# EAGLE design sensorTensao rev5.1 (EAGLE 8.5.1)
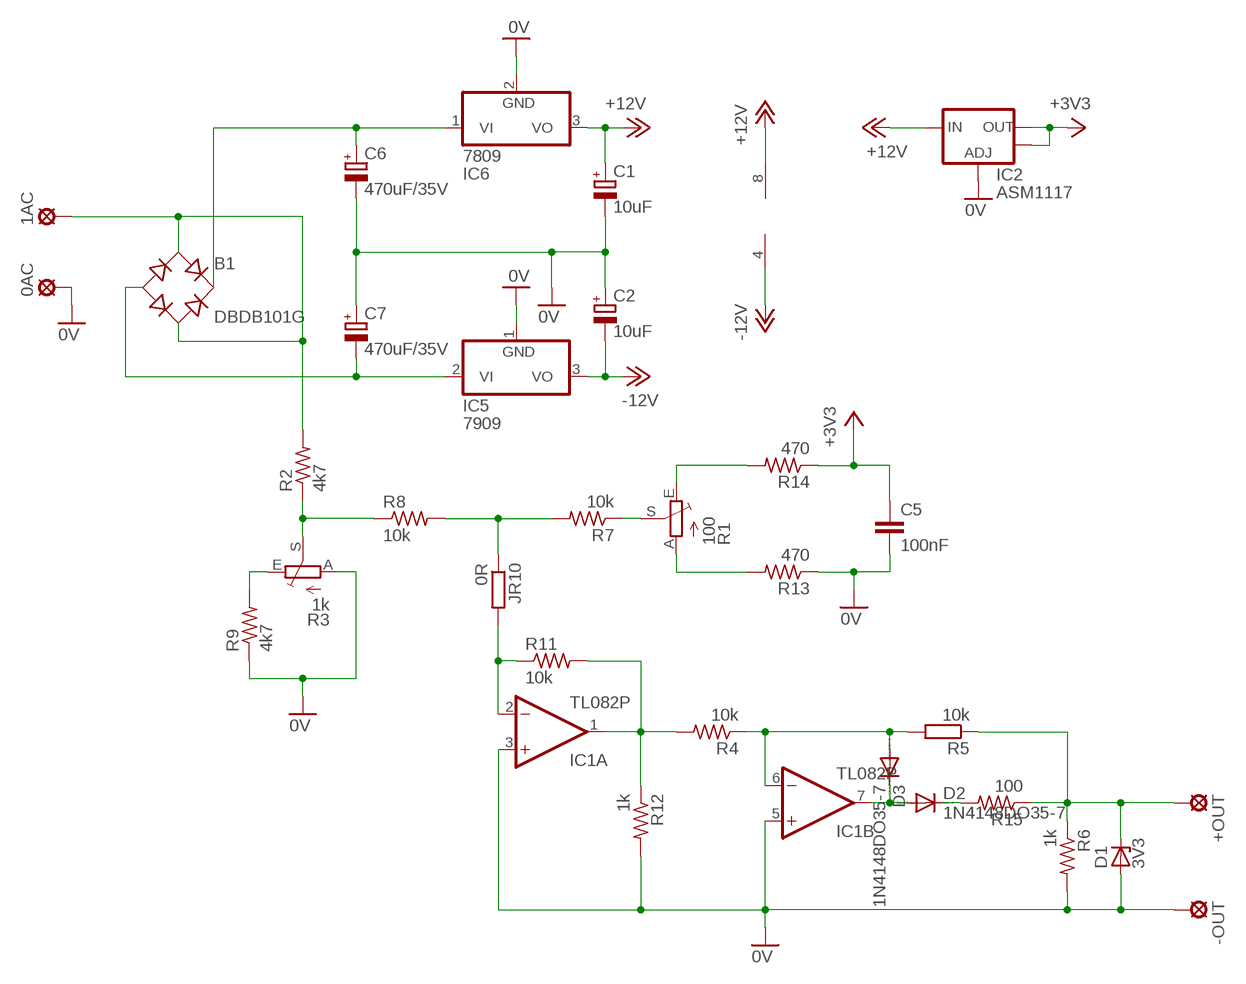
[diagram p0: schematic, sheet 1]

## Parts
0AC  0V  LSP10  [LSP10]
1AC  AC  LSP10  [LSP10]
+OUT  +D  LSP10  [LSP10]
-OUT  0V  LSP10  [LSP10]
B1  DBDB101G  [DB]
C1  10uF  CPOL-EUE2.5-7  [E2,5-7]
C2  10uF  CPOL-EUE2.5-7  [E2,5-7]
C5  100nF  C-EU050-024X044  [C050-024X044]
C6  470uF/35V  CPOL-EUE3.5-10  [E3,5-10]
C7  470uF/35V  CPOL-EUE3.5-10  [E3,5-10]
D1  3V3  ZENER-DIODEDO35-7Z  [DO35-7Z]
D2  1N4148DO35-7  [DO35-7]
D3  1N4148DO35-7  [DO35-7]
IC1  TL082P  [DIL08]
IC2  ASM1117  V_REG_LM1117SOT223  [SOT223]
IC5  7909  7912  [TO220V]
IC6  7809  7812TV  [TO220V]
JR10  0R  R-EU_0204/12  [0204/12]
R1  100  TRIM_EU-CA6V  [CA6V]
R2  4k7  R-US_0204/7  [0204/7]
R3  1k  TRIM_EU-CA6V  [CA6V]
R4  10k  R-US_0204/7  [0204/7]
R5  10k  R-EU_0204/10  [0204/10]
R6  1k  R-US_0204/7  [0204/7]
R7  10k  R-US_0204/7  [0204/7]
R8  10k  R-US_0204/7  [0204/7]
R9  4k7  R-US_0204/7  [0204/7]
R11  10k  R-US_0204/7  [0204/7]
R12  1k  R-US_0204/7  [0204/7]
R13  470  R-US_0204/7  [0204/7]
R14  470  R-US_0204/7  [0204/7]
R15  100  R-US_0204/7  [0204/7]

## Nets
0V: 0AC.MP -OUT.MP C1.- C2.+ C5.2 C6.- C7.+ D1.A IC1.3(A:+IN) IC1.5(B:+IN) IC2.1(ADJ) IC5.1(GND) IC6.2(GND) R3.A R6.2 R9.1 R12.2 R13.1
+3V3: C5.1 IC2.2(OUT) IC2.4(OUT) R14.1
+12V: C1.+ IC1.8(P:V+) IC2.3(IN) IC6.3(VO)
-12V: C2.- IC1.4(P:V-) IC5.3(VO)
N$1: R2.1 R3.S R8.1
N$2: B1.+ C6.+ IC6.1(VI)
N$3: 1AC.MP B1.AC1 B1.AC2 R2.2
N$4: R3.E R9.2
N$5: R1.S R7.1
N$6: IC1.2(A:-IN) JR10.2 R11.1
N$7: B1.- C7.- IC5.2(VI)
N$8: JR10.1 R7.2 R8.2
N$9: R1.E R14.2
N$10: IC1.1(A:OUT) R4.2 R11.2 R12.1
N$11: D3.A IC1.6(B:-IN) R4.1 R5.2
N$12: +OUT.MP D1.C R5.1 R6.1 R15.1
N$13: R1.A R13.2
N$14: D2.A D3.C IC1.7(B:OUT)
N$15: D2.C R15.2

## Library data of the parts
0AC 1AC +OUT -OUT = solpad:LSP10: SOLDER PAD drill 1.0 mm, distributor Buerklin, 12H555
B1 = rectifier:DB?*G: Single Phase 1.0 AMP Glass Passivated Bridge Rectifier Taiwan Semiconductor Co.,Ltd. - TSC Source: http://www.taiwansemi.com/TSCbig5/ezcatfiles/cust/img/img/db101g.pdf http://www.ts.com.tw/db/pictures/modules/PDT/PDT060207001/DBLS201G.pdf
C1 C2 C6 C7 = rcl:CPOL-EU: POLARIZED CAPACITOR, European symbol; SPICEPREFIX: C
C5 = rcl:C-EU: CAPACITOR, European symbol; SPICEPREFIX: C
D1 = diode:ZENER-DIODE: Z-Diode
D2 D3 = diode:1N4148: DIODE high speed (Philips)
IC1 = linear:TL082: OP AMP Data sheet <http://www.ti.com/lit/ds/symlink/tl084a . pdf>; DATA_SHEET: <a href="http://www.ti.com/lit/ds/symlink/tl084a.pdf"> Data sheet </a>
IC2 = SparkFun:V_REG_LM1117: Voltage Regulator LM1117 Standard adjustable voltage regulator but in SMD form. Spark Fun Electronics SKU : COM-00595
IC5 = linear:79*: Negative VOLTAGE REGULATOR
IC6 = linear:78*: Positive VOLTAGE REGULATOR Source: http://cache.national.com/ds/LM/LM78L05.pdf http://www.fairchildsemi.com/ds/LM/LM7805.pdf
JR10 R5 = rcl:R-EU_: RESISTOR, European symbol; SPICEPREFIX: R
R1 R3 = pot:TRIM_EU-: POTENTIOMETER
R2 R4 R6-R9 R11-R15 = resistor:R-US_: RESISTOR, American symbol

## Net classes
0 default: drill 0.889 mm, clearance 0.635 mm
1 0V: drill 0.889 mm, clearance 0.635 mm
2 +3V3: drill 0.889 mm, clearance 0.635 mm

## Board
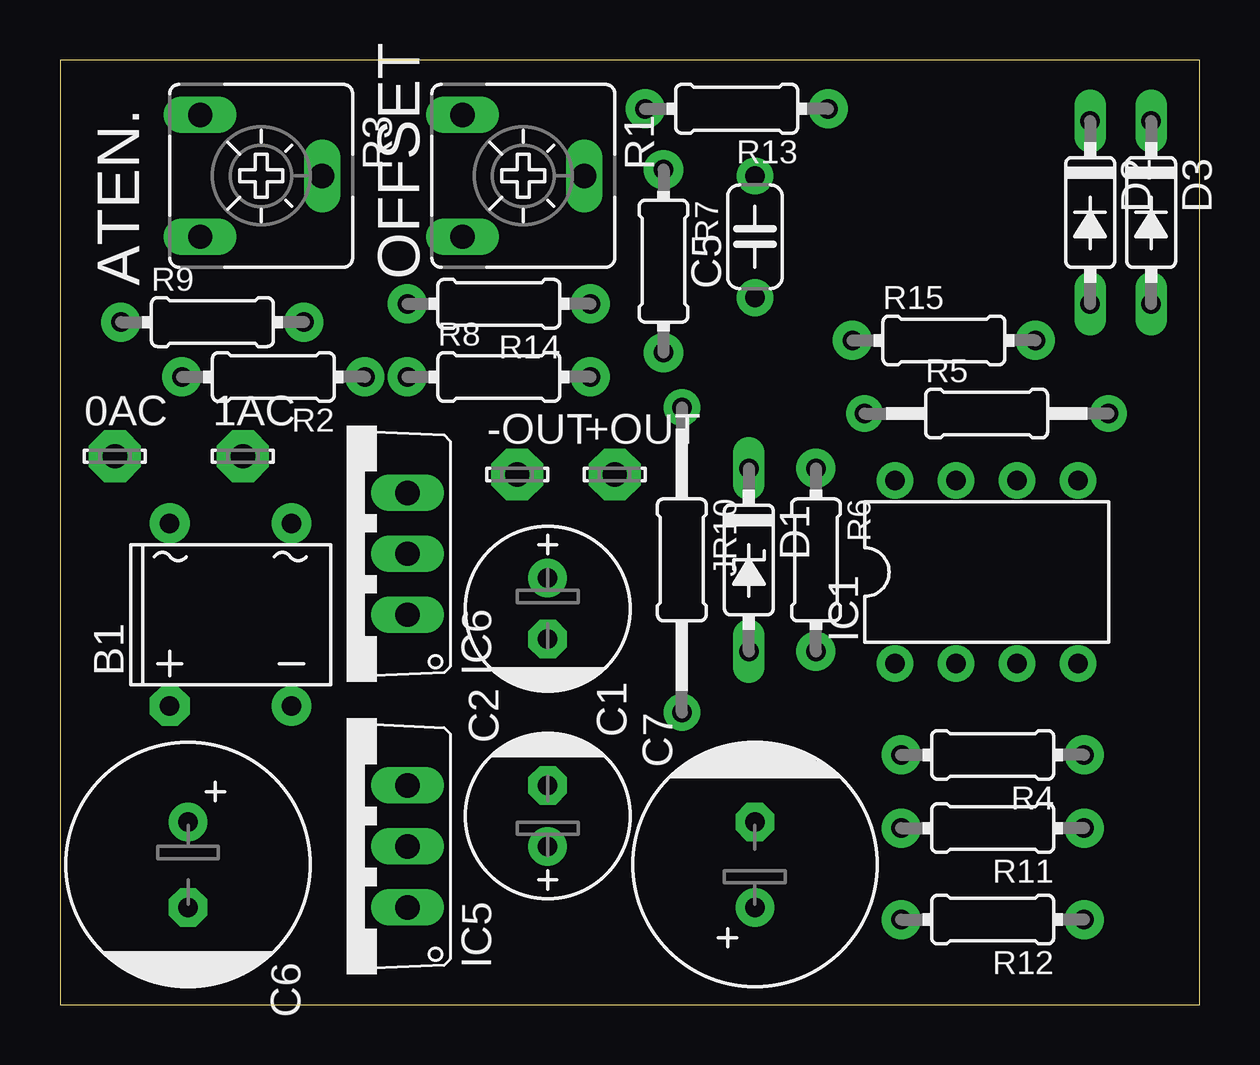
[diagram p1: board, top side]
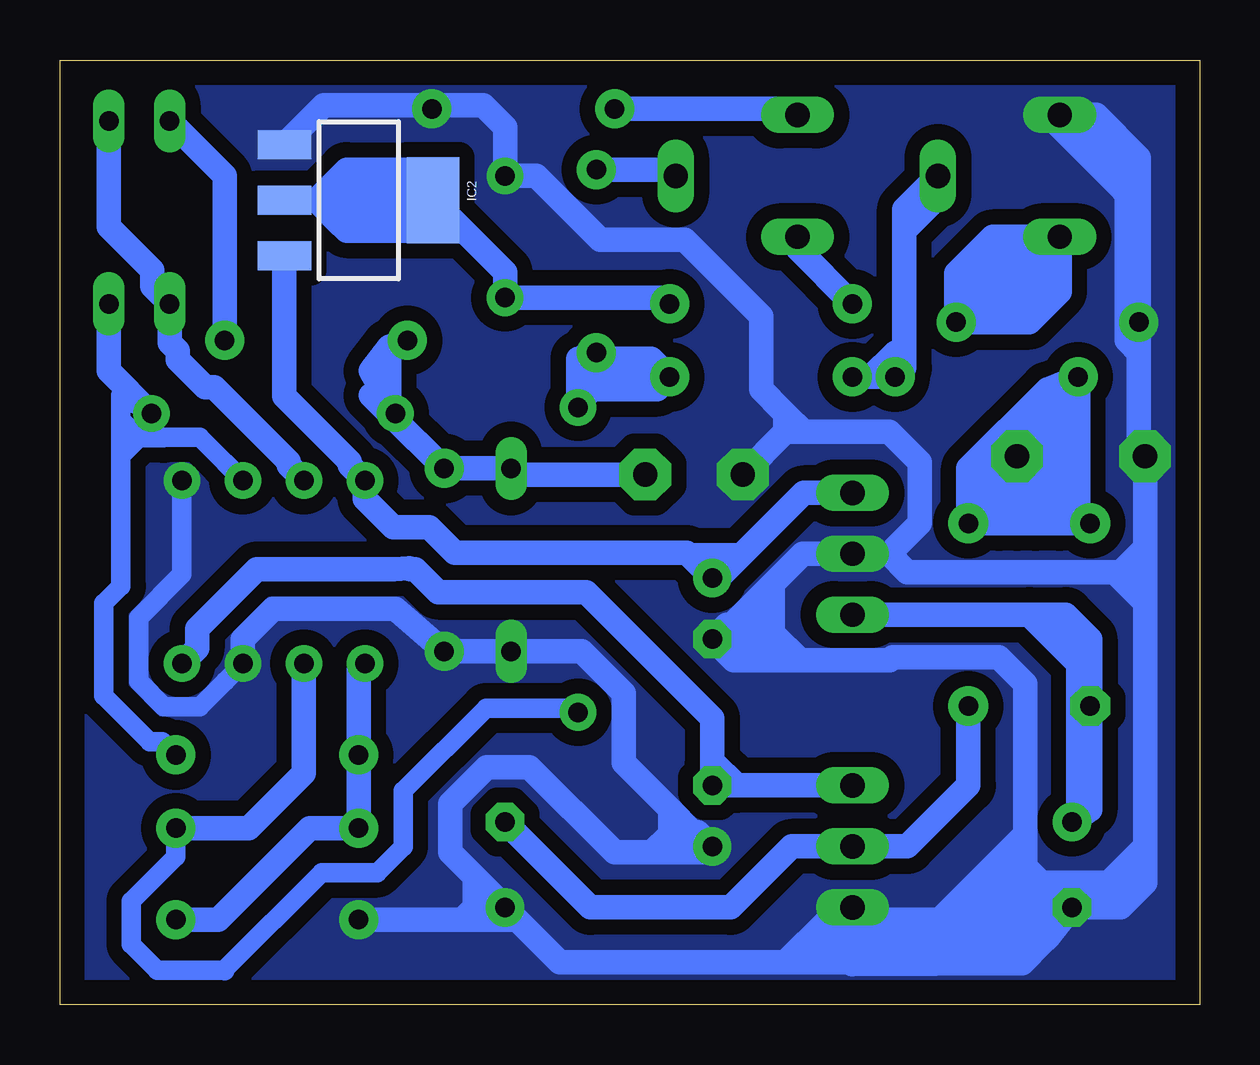
[diagram p2: board, bottom side, seen from below]

Size 47.5 x 39.37 mm. Coordinates in mm from the lower left corner, seen from the top.
Outline: 0,0 47.5,0 47.5,39.37 0,39.37 0,0
Copper layers (1*16): Top 0.035mm / dielectric 1.5mm / Bottom 0.035mm
Design rules "default": minimum track width 6mil, minimum drill 0.35mm, track to track 6mil, track to pad 6mil, pad to pad 6mil, via to via 6mil, smd to smd 6mil, copper to edge 40mil, drill to drill 6mil, minimum pad ring 10mil, minimum via ring 8mil, stop-mask expansion 4mil, vias tented up to drill 0mil, thermal gap 10mil

### Footprints (pad centres in the part's own frame; a part is rotated, then mirrored left to right if it is on the bottom)
LSP10 = drill 1.016 pad 2.159 octagon: MP 0,0
DB = drill 0.813 pad 1.651 octagon: + -2.54,-3.81 | drill 0.813 pad 1.651: - 2.54,-3.81; AC1 2.54,3.81; AC2 -2.54,3.81
E2,5-7 = drill 0.813 pad 1.6: + -1.27,0 | drill 0.813 pad 1.6 octagon: - 1.27,0
C050-024X044 = drill 0.813 pad 1.524: 1 -2.54,0; 2 2.54,0
E3,5-10 = drill 0.813 pad 1.6: + -1.778,0 | drill 0.813 pad 1.6 octagon: - 1.778,0
DO35-7Z = drill 0.813 long: A 3.81,0; C -3.81,0
DO35-7 = drill 0.813 long: A 3.81,0; C -3.81,0
DIL08 = drill 0.813 pad 1.524: 1 -3.81,-3.81; 2 -1.27,-3.81; 3 1.27,-3.81; 4 3.81,-3.81; 5 3.81,3.81; 6 1.27,3.81; 7 -1.27,3.81; 8 -3.81,3.81
SOT223 = smd 1.219 x 2.235: 1 -2.311,-3.099; 2 0,-3.099; 3 2.311,-3.099 | smd 3.6 x 2.2: 4 0,3.099
TO220V = drill 1.016 long: 1 -2.54,-2.54; 2 0,-2.54; 3 2.54,-2.54
0204/12 = drill 0.813 pad 1.524: 1 -6.35,0; 2 6.35,0
CA6V = drill 1.016 long: A -2.54,-2.54; E 2.54,-2.54; S 0,2.54
0204/7 = drill 0.813 pad 1.626: 1 -3.81,0; 2 3.81,0
0204/10 = drill 0.813 pad 1.524: 1 -5.08,0; 2 5.08,0

### Placement (x,y rotation side)
0AC  2.29,22.86 0 top
1AC  7.62,22.86 0 top
+OUT  23.11,22.1 0 top
-OUT  19.05,22.1 0 top
B1  7.11,16.26 0 top
C1  20.32,16.51 270 top
C2  20.32,7.87 90 top
C5  28.96,32 90 top
C6  5.33,5.84 270 top
C7  28.96,5.84 90 top
D1  28.7,18.54 270 top
D2  42.93,33.02 270 top
D3  45.47,33.02 270 top
IC1  38.61,18.03 0 top
IC2  35.05,33.53 270 bottom
IC5  11.94,6.6 90 top
IC6  11.94,18.8 90 top
JR10  25.91,18.54 270 top
R1  19.3,34.54 270 top
R2  8.89,26.16 180 top
R3  8.38,34.54 270 top
R4  38.86,10.41 180 top
R5  38.61,24.64 0 top
R6  31.5,18.54 270 top
R7  25.15,30.99 270 top
R8  18.29,26.16 0 top
R9  6.35,28.45 0 top
R11  38.86,7.37 180 top
R12  38.86,3.56 180 top
R13  28.19,37.34 180 top
R14  18.29,29.21 180 top
R15  36.83,27.69 0 top

### Tracks (layer width: path | path; a pad name or v marks a point on that pad's centre or on a via)
0V
  Bottom 0.813: IC1.5 42.42,17.94 44.22,16.14 44.22,13.48 43.16,12.42 41.67,12.42 40.62,13.48 40.62,13.49 IC1.3
  Bottom 1.016: 5.59,4.06 C6.- | C6.- 3.3,4.06 2.29,5.08 2.29,5.33 | 2.29,5.33 2.29,6.6 | 2.29,6.6 2.29,16.76 | 2.29,16.76 2.29,18.03 | 2.29,18.03 2.29,19.05 | 2.29,19.05 0AC.MP 2.54,23.11 2.54,27.18 | IC1.3 39.88,15.24 38.61,16.51 33.53,16.51 R6.2 D1.A 25.75,14.73 24,12.98 24,10.08 22.07,8.15 | IC1.3 40.05,14.22 | 6.35,2.79 6.6,2.54 | 6.6,2.54 7.37,1.78 | 28.45,3.56 26.67,1.78 17.27,1.78 | 28.45,3.56 C7.+ | 7.37,1.78 8.38,1.78 | 8.38,1.78 9.91,1.78 | 9.91,1.78 11.25,1.78 | 11.25,1.78 15.75,1.78 | 15.75,1.78 17.27,1.78 | C6.- 5.84,4.32 | 5.84,4.32 6.6,5.08 | 6.6,5.08 7.28,5.75 | 7.28,5.75 7.28,7.11 | 21.12,7.2 20.92,7.2 C2.+ 20.57,6.35 22.35,6.35 | 21.12,7.2 22.07,8.15 | 7.37,5.84 7.28,5.75 | 14.48,1.7 7.41,1.74 7.37,1.78 | 6.35,2.79 C6.- | 11.25,1.78 10.45,2.58 | 10.45,2.58 7.28,5.75 | 9.91,1.78 8.38,3.3 | 8.38,3.3 7.49,4.19 | 7.49,4.19 6.6,5.08 | 5.84,4.32 6.35,3.81 6.35,2.79 | 6.6,5.08 6.6,2.54 | 7.49,4.19 7.49,2.92 7.37,2.79 8.38,1.78 | 8.38,3.3 8.38,1.78 | 6.6,5.08 3.81,5.08 2.29,6.6 | 2.29,5.33 3.3,4.32 4.83,4.32 5.08,4.57 | 2.54,27.18 R9.1 2.54,35.31 4.32,37.08 R3.A 6.35,37.08 3.43,34.16 | 3.43,34.16 3.05,33.78 3.05,27.69 2.54,27.18 | 3.43,34.16 3.43,34.92 4.83,36.32 | 32,37.49 29.87,37.49 28.96,36.57 C5.2 27.66,34.54 24.99,31.88 21.46,31.88 18.29,28.7 18.29,25.65 17.4,24.77 17.27,24.64 | 39.88,14.07 IC1.3 | IC5.1 14.48,1.7 | 14.48,1.7 | 17.27,1.78 15.49,3.56 10.83,3.56 7.28,7.11 | 7.28,7.11 7.28,13.37 8.38,14.48 12.8,14.48 12.93,14.35 16.66,14.35 | 12.95,18.8 IC6.2 16.56,18.8 17.8,17.55 | 12.95,18.8 12.19,18.03 3.56,18.03 | 3.3,18.03 2.29,18.03 | 17.8,17.55 19.52,15.84 19.72,15.84 C1.- 19.43,14.35 18.29,14.35 | 16.66,14.35 17.27,14.35
  Bottom 1.016: 17.27,14.35 18.29,14.35 | 17.27,14.35 17.8,14.88 17.8,15.49 | 17.8,15.49 17.8,17.55 | 17.8,15.49 16.66,14.35 | 18.29,14.35 18.54,14.61 18.54,16 19.3,15.24 | 3.56,18.03 2.29,16.76 | 3.56,18.03 3.3,18.03 | 3.3,18.03 2.29,19.05 | 30.23,5.33 31.24,6.35 31.24,8.38 29.72,9.91 27.94,9.91 24.38,6.35 22.84,6.35 | 22.84,6.35 22.35,6.35 | 22.35,6.35 22.07,6.63 22.07,7.11 | 22.07,7.11 22.07,8.15 | 22.07,7.11 21.99,7.2 21.12,7.2 | 22.84,6.35 22.07,7.11 | 15.75,1.78 15.75,2.03 14.99,2.79 14.77,2.58 10.45,2.58 | R13.1 32,37.49 | 17.27,24.64 16.51,23.88 | 16.51,23.88 12.95,23.88 11.68,22.61 11.68,20.07 12.95,18.8 | IC2.1 36.5,37.49 32,37.49 | R12.2 30.73,3.56 | 30.73,3.56 29.72,3.56 | 29.72,3.56 C7.+ | 29.72,3.56 28.45,3.56 | 30.73,3.56 30.23,4.06 | 30.23,4.06 30.23,5.33 | C7.+ 30.23,5.33 | C7.+ 29.21,3.81 30.23,4.06 | -OUT.MP 17.27,23.88 | 17.27,23.88 16.51,23.88 | 17.27,23.88 17.27,24.64
  pour Bottom (no thermals): 1.02,38.86 1.02,0.25 46.74,0.25 46.74,39.12
+3V3
  Bottom 1.016: 36.83,33.53 IC2.4 | R14.1 22.35,29.46 C5.1 28.96,30.53 IC2.4 | IC2.4 31.95,33.22 31.45,33.22 | IC2.4 31.5,33.98 31.5,34.8 | IC2.2 36.83,33.53 | 36.83,33.53 35.94,32.64 | 35.94,32.64 35.56,32.26 31.24,32.26 | 35.94,32.64 33.15,32.64 33.02,32.77 | 36.83,33.53 35.56,34.8 32.51,34.8 32.26,34.54 32.51,34.29 35.31,34.29
+12V
  Bottom 0.813: 21.39,18.85 19,18.85 18.92,18.92
  Bottom 1.016: IC6.3 16.51,21.34 18.92,18.92 20.07,17.78 C1.+ 21.39,18.85 31.06,18.85 32.11,19.9 33.61,19.9 34.8,21.08 IC1.8 35.43,22.48 35.43,22.63 38.15,25.35 IC2.3
-12V
  Bottom 1.016: IC5.3 19.3,9.14 | 19.3,9.14 C2.- 20.32,10.16 | IC1.4 41.78,14.86 41.78,15.67 39.29,18.16 33.58,18.16 32.95,18.2 32.91,18.16 32.71,18.16 31.74,17.2 25.58,17.2 20.32,11.94 20.32,10.16 | 20.32,10.16 19.3,9.14
N$1
  Bottom 1.016: R2.1 12.7,27.18 13.72,26.16 | R8.1 13.72,26.16 | 13.72,26.16 R2.1 | R2.1 12.32,26.54 12.32,32.26 | 12.32,32.26 12.32,33.15 R3.S 10.92,33.66 12.32,32.26
N$2
  Bottom 1.016: 5.46,16.13 5.59,16.26 IC6.1 7.11,16.26 5.59,14.73 | 5.46,16.13 4.57,15.24 B1.+ 4.57,8.13 C6.+ 5.08,7.62 5.08,14.22 5.59,14.73 | 5.59,14.73 5.59,16 5.46,16.13
N$3
  Bottom 1.016: 5.84,20.07 B1.AC2 5.08,20.57 R2.2 | 5.84,20.07 6.86,20.07 | 6.86,20.07 7.62,20.07 | 7.62,20.07 8.38,20.07 | 8.38,20.07 B1.AC1 | 1AC.MP 6,24.96 | 6,24.96 R2.2 | 1AC.MP 7.62,20.83 | 7.62,20.83 7.62,20.07 | 7.62,20.83 8.13,20.32 | 7.62,20.83 7.24,20.45 | 7.24,20.45 6.86,20.07 | B1.AC1 9.65,22.35 6.35,25.65 R2.2 | B1.AC1 8.89,20.83 8.89,22.1 8.13,22.86 1AC.MP | 5.84,20.07 5.84,23.88 | 7.24,20.45 7.24,22.48 5.84,23.88 | 1AC.MP 6.6,21.84 | 6.6,21.84 6.6,20.83 | 6.6,21.84 6.6,22.35 6.35,22.61 7.37,22.61 8.13,21.84 8.13,20.32 | 8.13,20.32 8.38,20.07 | 5.84,23.88 6,24.04 6,24.96
N$4
  Bottom 1.016: R9.2 7.11,28.45 5.84,29.72 R3.E 8.64,32 8.89,31.75 | 9.4,29.46 7.37,29.46 6.35,30.48 6.35,31.75 6.86,31.75 R9.2 | 9.4,29.46 9.65,29.46 | R9.2 10.16,30.48 8.89,31.75 | 8.89,31.75 7.62,31.75 | 9.4,29.46 8.38,30.48 8.38,30.99 8.64,30.99 9.4,30.23 7.37,30.23 7.11,30.48 7.11,30.73
N$5
  Bottom 1.016: R1.S 22.1,34.8 R7.1
N$6
  Bottom 0.813: R11.1 42.67,6.18 44.53,4.32 44.53,2.53 43.44,1.45 40.66,1.45 | 40.66,1.45 40.64,1.42 | 40.66,1.45 36.6,5.51 34.28,5.51 33.2,6.6 33.2,8.91 29.74,12.37 26.34,12.37 JR10.2
  Bottom 1.016: IC1.2 37.34,9.65 39.62,7.37 R11.1
N$7
  Bottom 1.016: C7.- 25.4,4.06 19.56,4.06 17.02,6.6 IC5.2 12.19,6.6 9.65,9.14 B1.-
N$8
  Bottom 0.813: JR10.1 25.15,25.65 | R7.2 25.65,27.18 25.91,26.92
  Bottom 1.016: JR10.1 25.91,26.16 | 25.91,26.16 25.91,26.92 24.89,26.92 | 24.89,26.92 22.86,26.92 R8.2 | 25.91,26.16 25.65,26.16 24.89,26.92 | R8.2 24.64,26.16 | R8.2 22.61,25.65 25.15,25.65
N$9
  Bottom 1.016: R14.2 16.76,31.5 R1.E
N$10
  Bottom 1.016: IC1.1 35.05,13.97 R4.2 R11.2 37.08,7.37 40.89,3.56 R12.1
N$11
  Bottom 0.813: R4.1 43.23,10.97 43.77,10.97 45.67,12.88 45.67,16.73 44.96,17.45 44.96,22.86 | 44.96,22.86 44.96,23.62 | 44.96,23.62 44.96,24.38 | IC1.6 40.62,22.58 40.62,22.59 41.67,23.65 43.16,23.65 43.19,23.62 44.2,23.62 | 44.2,23.62 44.96,23.62 | 44.2,23.62 44.96,22.86 | 44.2,23.62 44.96,24.38 | 44.96,24.38 44.96,25.4 R5.2
  Bottom 1.016: R5.2 45.47,26.42 D3.A
N$12
  Bottom 1.016: +OUT.MP 28.45,22.1 D1.C R6.1 33.78,24.64 | 33.78,27.43 34.54,26.42 R5.1 33.78,24.64 | 33.78,27.43 R15.1 | 33.78,24.64 33.78,27.43 | 33.78,24.64 34.54,25.4
N$13
  Bottom 1.016: R1.A 17.02,37.34 R13.2
N$14
  Bottom 1.016: IC1.7 37.97,22.48 37.97,22.63 41.07,25.73 41.45,25.73 42.6,26.88 42.6,27.26 42.93,27.59 D2.A 43.66,29.95 43.66,30.62 45.47,32.42 D3.C
N$15
  Bottom 1.016: D2.C 40.64,34.54 R15.2

### Text on the board
tNames: ATEN. | OFFSET
tValues: + | OUT | AC | 0V